# EAGLE design Gate_main (EAGLE 6.6.0)
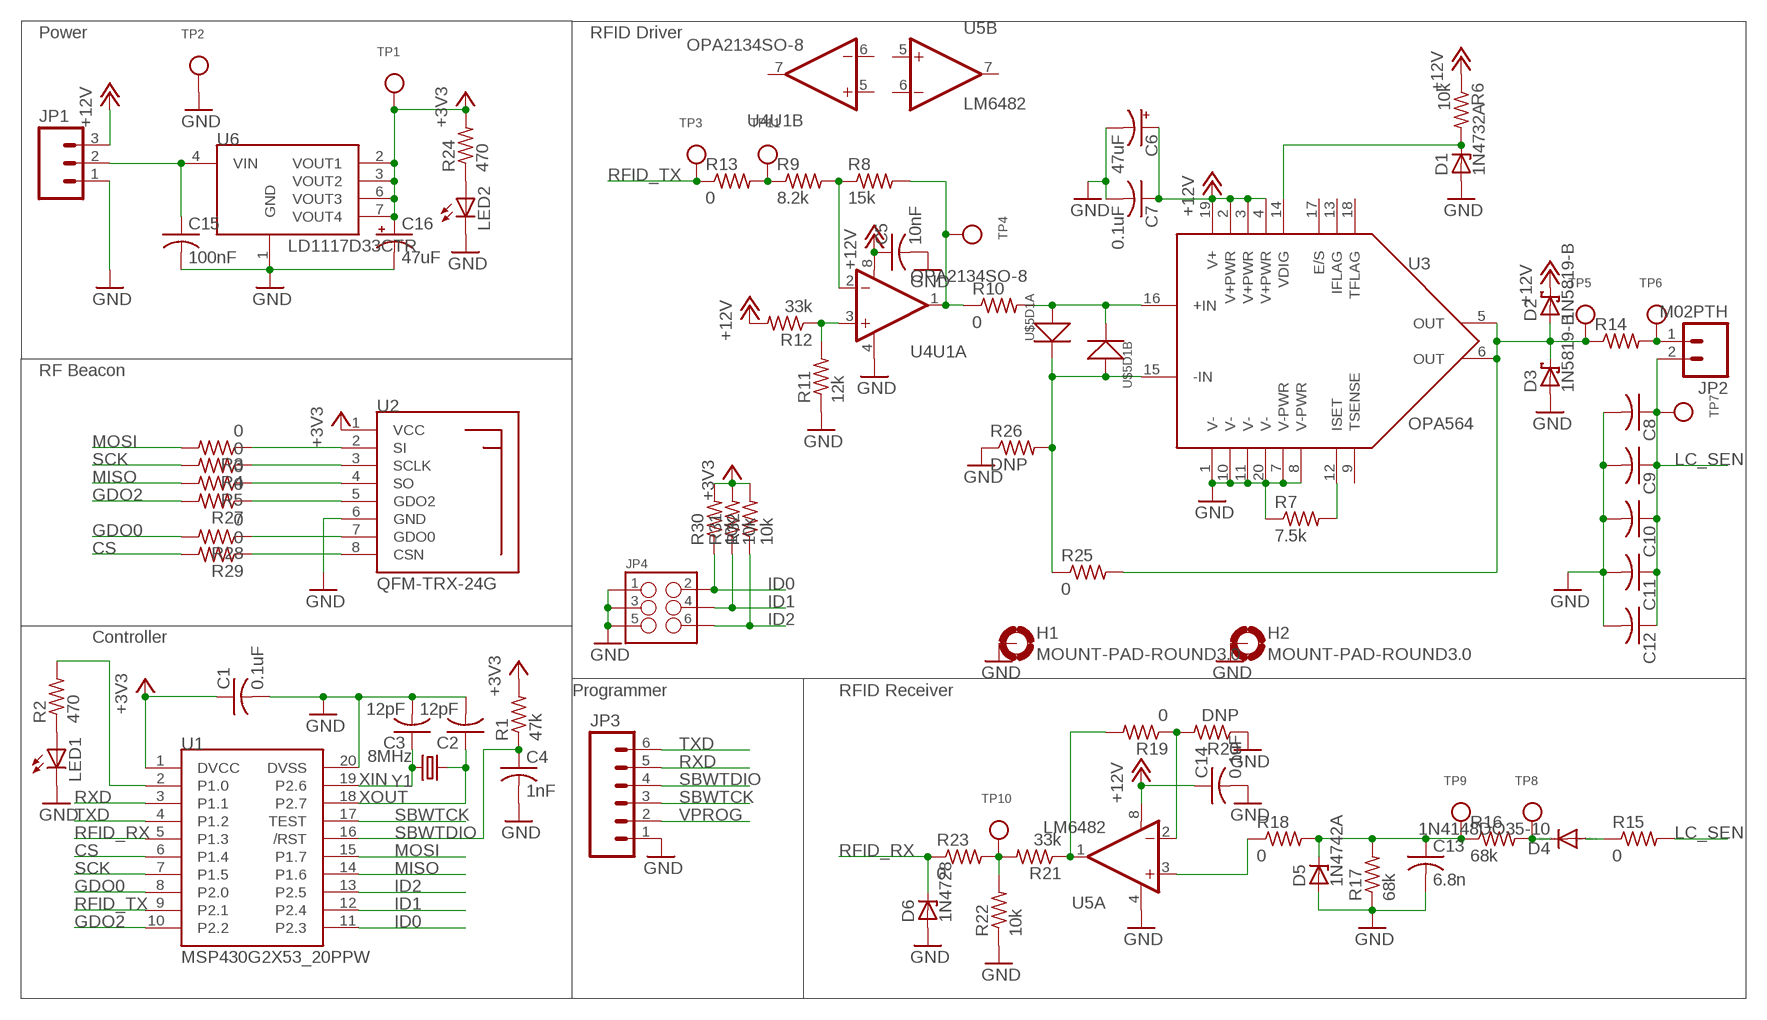
[diagram p0: schematic, sheet 1]

## Parts
C1  0.1uF  C-USC0805  [C0805]
C2  12pF  C-USC0805  [C0805]
C3  12pF  C-USC0805  [C0805]
C4  1nF  C-USC0805  [C0805]
C5  10nF  C-USC0805  [C0805]
C6  47uF  CPOL-USE2.5-6  [E2,5-6]
C7  0.1uF  C-USC0805  [C0805]
C8  C-USC0805  [C0805]
C9  C-USC0805  [C0805]
C10  C-USC0805  [C0805]
C11  C-USC0805  [C0805]
C12  C-USC0805  [C0805]
C13  6.8n  C-USC0805  [C0805]
C14  0.1uF  C-USC0805  [C0805]
C15  100nF  C-USC0805  [C0805]
C16  47uF  CPOL-USE2.5-6  [E2,5-6]
D1  1N4732A  1N4728  [DO41Z10]
D2  1N5819-B  [DO41-7.6]
D3  1N5819-B  [DO41-7.6]
D4  1N4148DO35-10  [DO35-10]
D5  1N4742A  1N4728  [DO41Z10]
D6  1N4728  [DO41Z10]
H1  MOUNT-PAD-ROUND3.0  [3,0-PAD]
H2  MOUNT-PAD-ROUND3.0  [3,0-PAD]
JP1  M03PTH  [1X03]
JP2  M02PTH  [1X02]
JP3  M06SIP  [1X06]
JP4  M03X22X3_SILK_SM  [2X3]
LED1  LEDCHIPLED_0603  [CHIPLED_0603]
LED2  LEDCHIPLED_0603  [CHIPLED_0603]
R1  47k  R-US_R0805  [R0805]
R2  470  R-US_R0805  [R0805]
R3  0  R-US_R0805  [R0805]
R4  0  R-US_R0805  [R0805]
R5  0  R-US_R0805  [R0805]
R6  10k  R-US_R0805  [R0805]
R7  7.5k  R-US_R0805  [R0805]
R8  15k  R-US_R0805  [R0805]
R9  8.2k  R-US_R0805  [R0805]
R10  0  R-US_R0805  [R0805]
R11  12k  R-US_R0805  [R0805]
R12  33k  R-US_R0805  [R0805]
R13  0  R-US_R0805  [R0805]
R14  R-US_0207/10  [0207/10]
R15  0  R-US_R0805  [R0805]
R16  68k  R-US_R0805  [R0805]
R17  68k  R-US_R0805  [R0805]
R18  0  R-US_R0805  [R0805]
R19  0  R-US_R0805  [R0805]
R20  DNP  R-US_R0805  [R0805]
R21  33k  R-US_R0805  [R0805]
R22  10k  R-US_R0805  [R0805]
R23  0  R-US_R0805  [R0805]
R24  470  R-US_R0805  [R0805]
R25  0  R-US_R0805  [R0805]
R26  DNP  R-US_R0805  [R0805]
R27  0  R-US_R0805  [R0805]
R28  0  R-US_R0805  [R0805]
R29  0  R-US_R0805  [R0805]
R30  10k  R-US_R0805  [R0805]
R31  10k  R-US_R0805  [R0805]
R32  10k  R-US_R0805  [R0805]
TP1  TESTPOINT0.1"  [1X01_ROUND]
TP2  TESTPOINT0.1"  [1X01_ROUND]
TP3  TESTPOINT0.1"  [1X01_ROUND]
TP4  TESTPOINT0.1"  [1X01_ROUND]
TP5  TESTPOINT0.1"  [1X01_ROUND]
TP6  TESTPOINT0.1"  [1X01_ROUND]
TP7  TESTPOINT0.1"  [1X01_ROUND]
TP8  TESTPOINT0.1"  [1X01_ROUND]
TP9  TESTPOINT0.1"  [1X01_ROUND]
TP10  TESTPOINT0.1"  [1X01_ROUND]
TP11  TESTPOINT0.1"  [1X01_ROUND]
U1  MSP430G2X53_20PPW  [PW(R-PDSO-G20)]
U2  QFM-TRX-24G  [QFM-TRX1-24G]
U3  OPA564  [SO-20LD]
U4  OPA2134SO-8  [SOIC8]
U5  LM6482  [SOIC8]
U6  LD1117D33CTR  [SOIC8]
U$5  SMS3922-015LF  [SMS3922-015LF]
Y1  8MHz  CRYSTALHC49UV  [HC49U-V]

## Nets
+3V3: C1.1 C16.+ R1.2 R24.2 R30.2 R31.2 R32.2 TP1.1 U1.1(DVCC) U2.1(VCC) U6.2(VOUT1) U6.3(VOUT2) U6.6(VOUT3) U6.7(VOUT4)
+6V: C15.1 JP1.2 U6.4(VIN)
+12V: C5.1 C6.+ C7.1 C14.1 D2.C JP1.3 R6.1 R12.2 U3.2(V+PWR) U3.3(V+PWR) U3.4(V+PWR) U3.19(V+) U4.8(U1A:V+) U5.8(A:V+)
BIAS_OUT: R8.2 R10.1 TP4.1 U4.1(U1A:OUT)
CS: R29.2 U1.6(P1.4)
GDO0: R28.2 U1.8(P2.0)
GDO2: R27.2 U1.10(P2.2)
GND: C1.2 C2.2 C3.2 C4.2 C5.2 C6.- C7.2 C8.2 C9.2 C10.2 C11.2 C12.2 C13.2 C14.2 C15.2 C16.- D1.A D3.A D5.A D6.A H1.B3,0(MOUNT) H2.B3,0(MOUNT) JP1.1 JP3.1 JP4.1 JP4.3 JP4.5 LED1.C LED2.C R7.1 R11.1 R17.1 R20.1 R22.1 R26.1 TP2.1 U1.20(DVSS) U2.6(GND) U3.1(V-) U3.7(V-PWR) U3.8(V-PWR) U3.10(V-) U3.11(V-) U3.20(V-) U4.4(U1A:V-) U5.4(A:V-) U6.1(GND)
ID0: JP4.2 R30.1 U1.11(P2.3)
ID1: JP4.4 R31.1 U1.12(P2.4)
ID2: JP4.6 R32.1 U1.13(P2.5)
ISET: R7.2 U3.12(ISET)
LC_SEN: C8.1 C9.1 C10.1 C11.1 C12.1 JP2.2 R15.2 TP7.1
MISO: R5.2 U1.14(P1.6)
MOSI: R3.2 U1.15(P1.7)
N$1: LED1.A R2.1
N$2: R5.1 U2.4(SO)
N$3: R4.1 U2.3(SCLK)
N$4: R3.1 U2.2(SI)
N$5: R8.1 R9.2 U4.2(U1A:-IN)
N$6: R10.2 U3.16(+IN) U$5.2(D1B:K) U$5.4(D1A:A)
N$7: R11.2 R12.1 U4.3(U1A:+IN)
N$8: R9.1 R13.2 TP11.1
N$9: JP2.1 R14.2 TP6.1
N$10: D4.C R16.2 TP8.1
N$11: D4.A R15.1
N$12: R25.1 R26.2 U3.15(-IN) U$5.1(D1A:K) U$5.3(D1B:A)
N$13: C13.1 D5.C R16.1 R17.2 R18.2 TP9.1
N$14: R19.1 R20.2 U5.2(A:-IN)
N$15: R19.2 R21.1 U5.1(A:OUT)
N$16: R18.1 U5.3(A:+IN)
N$17: R21.2 R22.2 R23.2 TP10.1
N$18: R2.2 U1.2(P1.0)
N$19: LED2.A R24.1
N$20: R29.1 U2.8(CSN)
N$21: R28.1 U2.7(GDO0)
N$22: R27.1 U2.5(GDO2)
PA_OUT: D2.A D3.C R14.1 R25.2 TP5.1 U3.5(OUT) U3.6(OUT)
RFID_RX: D6.C R23.1 U1.5(P1.3)
RFID_TX: R13.1 TP3.1 U1.9(P2.1)
RXD: JP3.5 U1.3(P1.1)
SBWTCK: JP3.3 U1.17(TEST)
SBWTDIO: C4.1 JP3.4 R1.1 U1.16(/RST)
SCK: R4.2 U1.7(P1.5)
TXD: JP3.6 U1.4(P1.2)
VDIG: D1.C R6.2 U3.14(VDIG)
VPROG: JP3.2
XIN: C3.1 U1.19(P2.6) Y1.2
XOUT: C2.1 U1.18(P2.7) Y1.1
Unconnected: U3.9(TSENSE) U3.13(IFLAG) U3.17(E/S) U3.18(TFLAG) U4.5(U1B:+IN) U4.6(U1B:-IN) U4.7(U1B:OUT) U5.5(B:+IN) U5.6(B:-IN) U5.7(B:OUT)

## Notes on the sheet
- Power | RFID Driver
- RF Beacon
- Controller
- Programmer | RFID Receiver

## Library data of the parts
C1-C5 C7-C15 = rcl:C-US: CAPACITOR, American symbol
C6 C16 = rcl:CPOL-US: POLARIZED CAPACITOR, American symbol
D1 D5 D6 = diode:1N4728: Z DIODE 3.3 V, 1W, 5 percent
D2 D3 = diode:1N581*: 1.0A SCHOTTKY BARRIER RECTIFIER Source: http://www.diodes.com/datasheets/ds23001.pdf
D4 = diode:1N4148: DIODE high speed (Philips)
H1 H2 = holes:MOUNT-PAD-ROUND: MOUNTING PAD, round
JP1 = SparkFun-Connectors:M03: Header 3 Standard 3-pin 0.1" header. Use with straight break away headers (SKU : PRT-00116), right angle break away headers (PRT-00553), swiss pins (PRT-00743), machine pins (PRT-00117), and female headers (PRT-00115). Molex polarized connector foot print use with SKU : PRT-08232 with associated crimp pins and housings.
JP2 = SparkFun-Connectors:M02: Standard 2-pin 0.1" header. Use with - straight break away headers ( PRT-00116) - right angle break away headers (PRT-00553) - swiss pins (PRT-00743) - machine pins (PRT-00117) - female headers (PRT-00115) Molex polarized connector foot print use with: PRT-08233 with associated crimp pins and housings. 2.54_SCREWTERM for use with PRT-10571. 3.5mm Screw Terminal footprints for PRT-08084 5mm Screw Terminal footprints for use with PRT-08433
JP3 = SparkFun-Connectors:M06: Header 6 Standard 6-pin 0.1" header. Use with straight break away headers (SKU : PRT-00116), right angle break away headers (PRT-00553), swiss pins (PRT-00743), machine pins (PRT-00117), and female headers (PRT-00115). Molex polarized connector foot print use with SKU : PRT-08094 with associated crimp pins and housings. NOTES ON THE VARIANTS LOCK and LOCK_LONGPADS... This footprint was designed to help hold the alignment of a through-hole component (i.e. 6-pin header) while soldering it into place. You may notice that each hole has been shifted either up or down by 0.005 of an inch from it's more standard position (which is a perfectly straight line). This slight alteration caused the pins (the squares in the middle) to touch the edges of the holes. Because they are alternating, it causes a "brace" to hold the component in place. 0.005 has proven to be the perfect amount of "off-center" position when using our standard breakaway headers. Although looks a little odd when you look at the bare footprint, once you have a header in there, the alteration is very hard to notice. Also,if you push a header all the way into place, it is covered up entirely on the bottom side. This idea of altering the position of holes to aid alignment will be further integrated into the Sparkfun Library for other footprints. It can help hold any component with 3 or more connection pins.
JP4 = SparkFun-Connectors:M03X2: 2x3 .1" header. Shrouded, with keying- CONN-10681 SMT- CONN-11415 Pogo pins- HW-11044
LED1 LED2 = led:LED: LED OSRAM: - CHIPLED LG R971, LG N971, LY N971, LG Q971, LY Q971, LO R971, LY R971 LH N974, LH R974 LS Q976, LO Q976, LY Q976 LO Q996 - Hyper CHIPLED LW Q18S LB Q993, LB Q99A, LB R99A - SideLED LS A670, LO A670, LY A670, LG A670, LP A670 LB A673, LV A673, LT A673, LW A673 LH A674 LY A675 LS A676, LA A676, LO A676, LY A676, LW A676 LS A679, LY A679, LG A679 - Hyper Micro SIDELED® LS Y876, LA Y876, LO Y876, LY Y876 LT Y87S - SmartLED LW L88C, LW L88S LB L89C, LB L89S, LG L890 LS L89K, LO L89K, LY L89K LS L896, LA L896, LO L896, LY L896 - TOPLED LS T670, LO T670, LY T670, LG T670, LP T670 LSG T670, LSP T670, LSY T670, LOP T670, LYG T670 LG T671, LOG T671, LSG T671 LB T673, LV T673, LT T673, LW T673 LH T674 LS T676, LA T676, LO T676, LY T676, LB T676, LH T676, LSB T676, LW T676 LB T67C, LV T67C, LT T67C, LS T67K, LO T67K, LY T67K, LW E67C LS E67B, LA E67B, LO E67B, LY E67B, LB E67C, LV E67C, LT E67C LW T67C LS T679, LY T679, LG T679 LS T770, LO T770, LY T770, LG T770, LP T770 LB T773, LV T773, LT T773, LW T773 LH T774 LS E675, LA E675, LY E675, LS T675 LS T776, LA T776, LO T776, LY T776, LB T776 LHGB T686 LT T68C, LB T68C - Hyper Mini TOPLED® LB M676 - Mini TOPLED Santana® LG M470 LS M47K, LO M47K, LY M47K Source: http://www.osram.convergy.de LUXEON: - LUMILED® LXK2-PW12-R00, LXK2-PW12-S00, LXK2-PW14-U00, LXK2-PW14-V00 LXK2-PM12-R00, LXK2-PM12-S00, LXK2-PM14-U00 LXK2-PE12-Q00, LXK2-PE12-R00, LXK2-PE12-S00, LXK2-PE14-T00, LXK2-PE14-U00 LXK2-PB12-K00, LXK2-PB12-L00, LXK2-PB12-M00, LXK2-PB14-N00, LXK2-PB14-P00, LXK2-PB14-Q00 LXK2-PR12-L00, LXK2-PR12-M00, LXK2-PR14-Q00, LXK2-PR14-R00 LXK2-PD12-Q00, LXK2-PD12-R00, LXK2-PD12-S00 LXK2-PH12-R00, LXK2-PH12-S00 LXK2-PL12-P00, LXK2-PL12-Q00, LXK2-PL12-R00 Source: www.luxeon.com KINGBRIGHT: KA-3528ASYC Source: www.kingbright.com
R1-R32 = rcl:R-US_: RESISTOR, American symbol
TP1-TP11 = microbuilder:TESTPOINT: Test Point Various test points for characterisation and PCB testing TESTPOINT_SMT - Compact Surface Mount Test Point [Digikey: 5016KTR-ND]; BOM: EXCLUDE
U1 = npol:MSP430G2X53_20P: MSP430G2x53 16-bit Microcontroller, 20pin devices
U2 = npol:QFM-TRX-24G
U3 = npol:OPA564
U4 = npol:OPA2134
U5 = npol:LM6482
U6 = npol:LD1117D33CTR
U$5 = npol:SMS3922-015LF
Y1 = SparkFun-FreqCtrl:CRYSTAL: Various standard crystals. Proven footprints. Spark Fun Electronics SKU : COM-00534

## Board
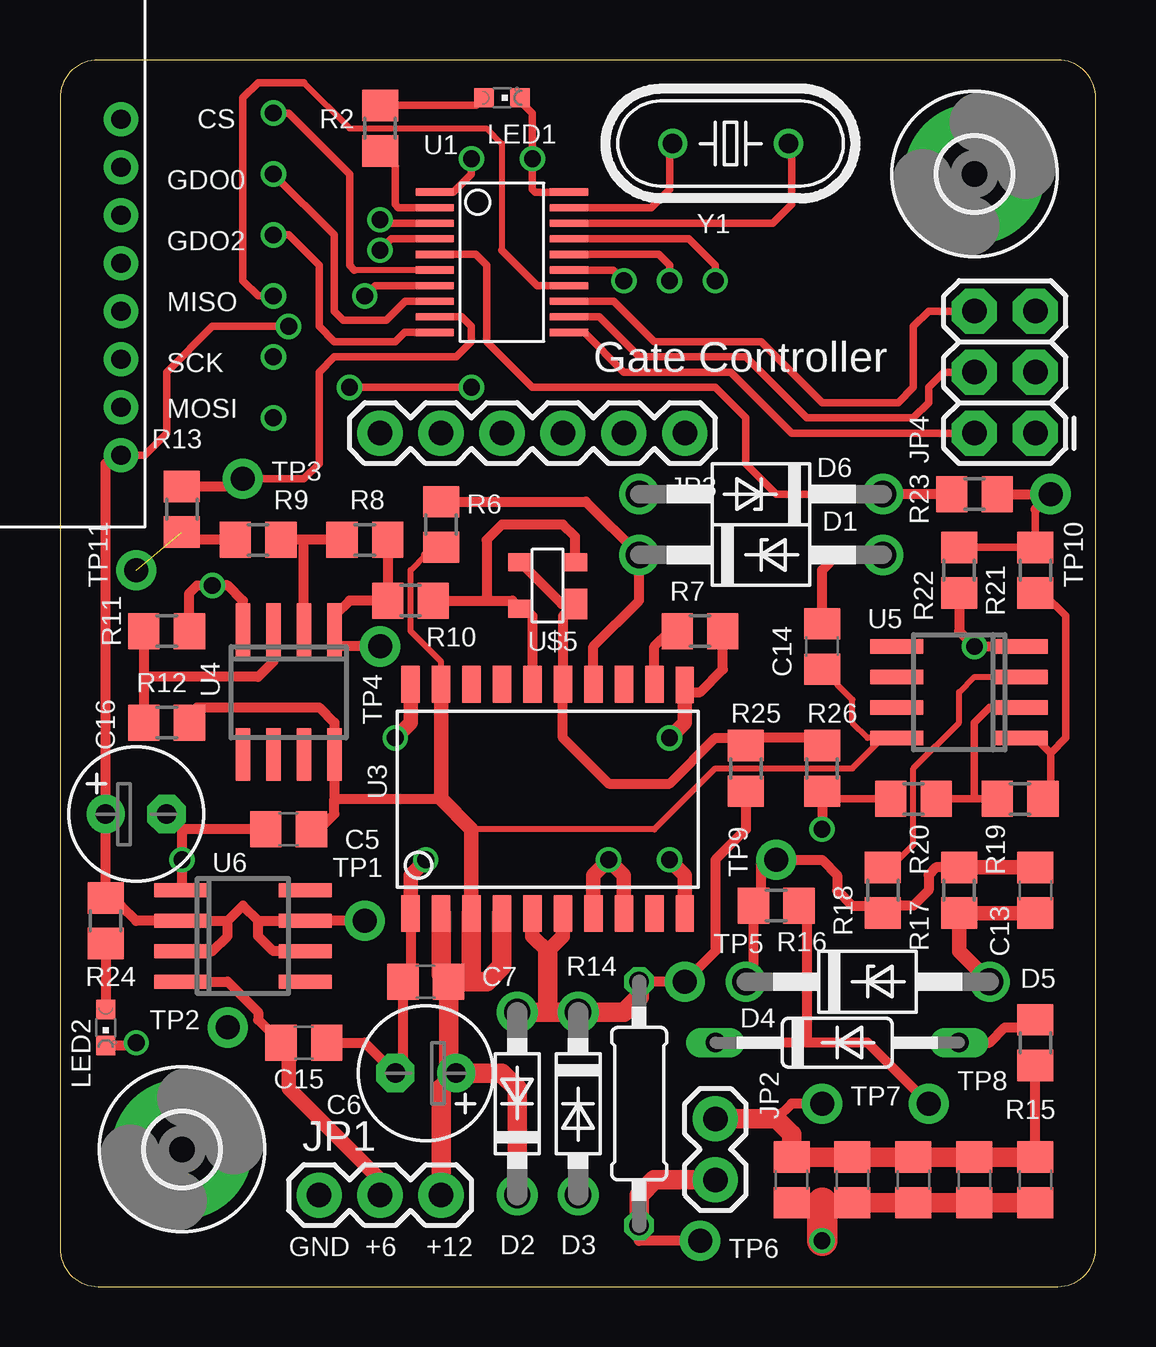
[diagram p1: board, top side]
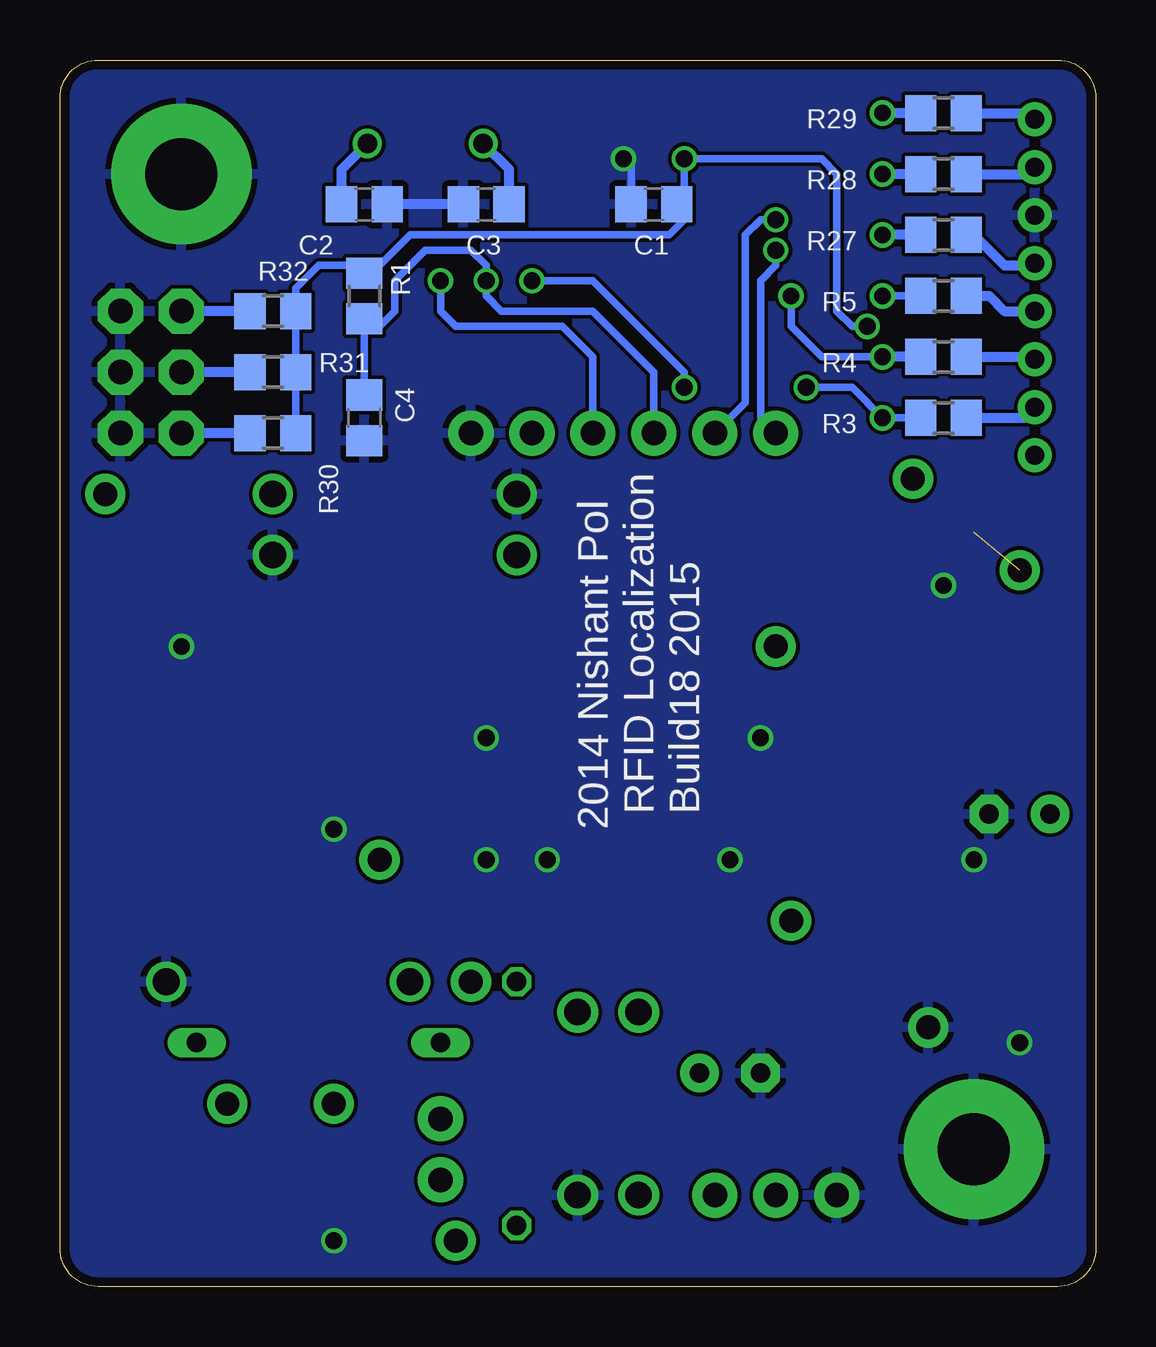
[diagram p2: board, bottom side, seen from below]

Size 43.16 x 51.1 mm. Coordinates in mm from the lower left corner, seen from the top.
Outline: 0,49.52 0,1.59 arc90 1.59,0 41.57,0 arc90 43.16,1.59 43.16,49.52 arc90 41.57,51.1 1.59,51.1 arc90 0,49.52
Copper layers (1*16): Top 0.0356mm / dielectric 1.5011mm / Bottom 0.0356mm
Design rules "OshPark": minimum track width 6mil, minimum drill 13mil, track to track 6mil, track to pad 6mil, pad to pad 6mil, via to via 6mil, smd to smd 6mil, copper to edge 15mil, drill to drill 6mil, minimum pad ring 7mil, minimum via ring 7mil, stop-mask expansion 4mil, vias tented up to drill 0mil, thermal gap 10mil

### Footprints (pad centres in the part's own frame; a part is rotated, then mirrored left to right if it is on the bottom)
C0805 = smd 1.3 x 1.5: 1 -0.95,0; 2 0.95,0
E2,5-6 = drill 0.813 pad 1.6: + -1.27,0 | drill 0.813 pad 1.6 octagon: - 1.27,0
DO41Z10 = drill 1.118: A 5.08,0; C -5.08,0
DO41-7.6 = drill 1.1 pad 1.7: A 3.81,0; C -3.81,0
DO35-10 = drill 0.813 long: A 5.08,0; C -5.08,0
3,0-PAD = drill 3 pad 5.842: B3,0 0,0
1X03 = drill 1.016 pad 1.88: 1 0,0; 2 2.54,0; 3 5.08,0
1X02 = drill 1.016 pad 1.88: 1 0,0; 2 2.54,0
1X06 = drill 1.016 pad 1.88: 1 0,0; 2 2.54,0; 3 5.08,0; 4 7.62,0; 5 10.16,0; 6 12.7,0
2X3 = drill 1.016 pad 1.88 octagon: 1 0,0; 2 0,2.54; 3 2.54,0; 4 2.54,2.54; 5 5.08,0; 6 5.08,2.54
CHIPLED_0603 = smd 0.8 x 0.8: A 0,-0.75; C 0,0.75
R0805 = smd 1.3 x 1.5: 1 -0.95,0; 2 0.95,0
0207/10 = drill 0.813 octagon: 1 -5.08,0; 2 5.08,0
1X01_ROUND = drill 1 pad 1.676: 1 0,0
PW(R-PDSO-G20) = smd 0.3 x 1.6: 1 -2.425,-2.8; 2 -1.775,-2.8; 3 -1.125,-2.8; 4 -0.475,-2.8; 5 0.175,-2.8; 6 0.825,-2.8; 7 1.475,-2.8; 8 2.125,-2.8; 9 2.775,-2.8; 10 3.425,-2.8; 11 3.425,2.8; 12 2.775,2.8; 13 2.125,2.8; 14 1.475,2.8; 15 0.825,2.8; 16 0.175,2.8; 17 -0.475,2.8; 18 -1.125,2.8; 19 -1.775,2.8; 20 -2.425,2.8
QFM-TRX1-24G = drill 0.8 pad 1.422: 1 -6,0; 2 -4,0; 3 -2,0; 4 0,0; 5 2,0; 6 4,0; 7 6,0; 8 8,0
SO-20LD = smd 0.762 x 1.524: 1 -5.715,-4.775; 2 -4.445,-4.775; 3 -3.175,-4.775; 4 -1.905,-4.775; 5 -0.635,-4.775; 6 0.635,-4.775; 7 1.905,-4.775; 8 3.175,-4.775; 9 4.445,-4.775; 10 5.715,-4.775; 11 5.715,4.75; 12 4.445,4.775; 13 3.175,4.775; 14 1.905,4.775; 15 0.635,4.775; 16 -0.635,4.775; 17 -1.905,4.775; 18 -3.175,4.775; 19 -4.445,4.775; 20 -5.715,4.775
SOIC8 = smd 0.6 x 2.2: 1 -1.905,-2.6; 2 -0.635,-2.6; 3 0.635,-2.6; 4 1.905,-2.6; 5 1.905,2.6; 6 0.635,2.6; 7 -0.635,2.6; 8 -1.905,2.6
SMS3922-015LF = smd 1.27 x 1.016: 1 -0.762,-1.143 | smd 0.762 x 1.016: 2 0.965,-1.143; 3 0.965,1.143; 4 -0.965,1.143
HC49U-V = drill 0.813: 1 -2.413,0; 2 2.413,0

### Placement (x,y rotation side)
C1  18.41,45.09 180 bottom
C2  30.48,45.09 0 bottom
C3  25.4,45.09 180 bottom
C4  30.48,36.2 270 bottom
C5  9.53,19.05 180 top
C6  15.24,8.89 180 top
C7  15.24,12.7 180 top
C8  40.64,4.45 270 top
C9  38.1,4.45 270 top
C10  33.02,4.45 270 top
C11  35.56,4.45 270 top
C12  30.48,4.45 270 top
C13  40.64,16.51 270 top
C14  31.75,26.67 90 top
C15  10.16,10.16 0 top
C16  3.17,19.68 0 top
D1  29.21,30.48 0 top
D2  19.05,7.62 90 top
D3  21.59,7.62 270 top
D4  32.38,10.16 0 top
D5  33.66,12.7 0 top
D6  29.21,33.02 180 top
H1  38.1,46.35 0 top
H2  5.08,5.71 0 top
JP1  10.79,3.81 0 top
JP2  27.3,4.45 90 top
JP3  26.04,35.56 180 top
JP4  40.64,35.56 90 top
LED1  18.41,49.53 270 top
LED2  1.91,10.79 180 top
R1  30.48,41.27 90 bottom
R2  13.34,48.26 270 top
R3  6.35,36.2 180 bottom
R4  6.35,38.73 180 bottom
R5  6.35,41.27 180 bottom
R6  15.88,31.75 90 top
R7  26.67,27.3 180 top
R8  12.7,31.11 0 top
R9  8.26,31.11 0 top
R10  14.61,28.57 0 top
R11  4.45,27.3 180 top
R12  4.45,23.5 0 top
R13  5.08,32.38 270 top
R14  24.13,7.62 270 top
R15  40.64,10.16 270 top
R16  29.84,15.88 0 top
R17  37.47,16.51 90 top
R18  34.29,16.51 270 top
R19  40.01,20.32 0 top
R20  35.56,20.32 0 top
R21  40.64,29.84 90 top
R22  37.47,29.84 90 top
R23  38.1,33.02 0 top
R24  1.91,15.24 90 top
R25  28.57,21.59 270 top
R26  31.75,21.59 90 top
R27  6.35,43.81 180 bottom
R28  6.35,46.35 180 bottom
R29  6.35,48.9 180 bottom
R30  34.29,35.56 0 bottom
R31  34.29,38.1 0 bottom
R32  34.29,40.64 0 bottom
TP1  12.7,15.24 0 top
TP2  6.99,10.79 0 top
TP3  7.62,33.66 0 top
TP4  13.34,26.67 0 top
TP5  26.04,12.7 0 top
TP6  26.67,1.91 0 top
TP7  31.75,7.62 0 top
TP8  36.2,7.62 0 top
TP9  29.84,17.78 0 top
TP10  41.27,33.02 0 top
TP11  3.17,29.84 0 top
U1  18.41,43.18 270 top
U2  2.54,40.64 90 top
U3  20.32,20.32 0 top
U4  9.53,24.77 180 top
U5  37.47,24.77 90 top
U6  7.62,14.61 270 top
U$5  20.32,29.21 90 top
Y1  27.94,47.62 180 top

### Tracks (layer width: path | path; a pad name or v marks a point on that pad's centre or on a via)
+3V3  (via drill 0.7)
  Top 0.305: 1.91,34.29 2.19,34.29 U2.1 3.52,34.64 4.45,35.56 4.45,38.1 6.35,40.01 v9.53,40.01 | U1.1 16.39,45.6 17.14,46.35 v17.14,46.99
  Top 0.406: U6.3 6.35,13.97 6.99,14.61 6.99,15.24 | U6.6 8.89,13.97 8.26,14.61 8.26,15.24 | 8.26,15.24 U6.7 TP1.1 | 6.99,15.24 U6.2 3.17,15.24 2.54,15.88 2.22,15.88 R24.2 C16.+ 1.91,34.29 | 6.99,15.24 7.62,15.88 8.26,15.24
  Bottom 0.305: R30.2 R31.2 R32.2 33.34,41.59 32.38,42.55 30.8,42.55 R1.2 30.16,42.23 28.57,43.81 17.78,43.81 17.14,44.45 17.14,44.77 | 17.14,44.77 C1.1 | v9.53,40.01 10.16,40.01 10.79,40.64 10.79,46.35 11.43,46.99 v17.14,46.99 17.14,44.77
+6V
  Top 0.406: U6.4 6.99,12.7 8.26,11.43 8.26,11.12 C15.1
  Top 0.61: JP1.2 13.34,4.45 9.53,8.26 9.53,9.85 C15.1
+12V
  Top 0.254: U3.19 15.88,26.04 14.61,27.3 14.61,29.84 15.24,30.48 | 17.14,19.05 24.77,19.05 27.3,21.59 33.02,21.59 34.29,22.86 | 34.29,22.86 U5.8 | 34.29,22.86 33.66,22.86 33.02,23.5 33.02,24.45 C14.1
  Top 0.406: 11.43,20.32 U4.8 11.43,23.5 10.79,24.13 5.71,24.13 5.39,23.81 R12.2 | 11.43,20.32 15.88,20.32 | C5.1 10.79,19.05 11.43,19.68 11.43,20.32 | 15.24,30.48 15.88,30.48 R6.1
  Top 0.61: U3.19 15.88,20.32 17.14,19.05 U3.3
  Top 0.813: C6.+ 18.41,8.89 19.05,8.26 D2.C | U3.3 17.14,12.7 | 17.14,12.7 C7.1 | U3.2 15.88,13.02 C7.1 | U3.4 18.41,13.34 17.78,12.7 17.14,12.7 | JP1.3 15.88,8.26 C6.+ | C7.1 16.19,9.21 C6.+
BIAS_OUT
  Top 0.406: TP4.1 11.43,26.67 U4.1 11.43,27.94 12.06,28.57 R10.1 R8.2
CS  (via drill 0.7)
  Top 0.254: U1.6 12.26,42.35
  Top 0.305: v8.89,48.9 9.53,48.9 12.06,46.35 12.06,42.55 12.26,42.35
  Bottom 0.406: R29.2 v8.89,48.9
GDO0  (via drill 0.7)
  Top 0.305: v8.89,46.35 11.43,43.81 11.43,40.64 11.8,40.27 13.6,40.27 14.38,41.05 U1.8
  Bottom 0.406: R28.2 v8.89,46.35
GDO2  (via drill 0.7)
  Top 0.305: v8.89,43.81 9.53,43.81 10.79,42.55 10.79,40.01 11.43,39.37 13.97,39.37 14.36,39.76 U1.10
  Bottom 0.406: R27.2 v8.89,43.81
GND  (via drill 0.7)
  Top 0.305: LED1.C 19.16,49.41 19.68,48.9 v19.68,46.99 19.68,45.72 19.8,45.6 U1.20 | R20.1 32.07,20.32 R26.1
  Top 0.406: U3.1 14.61,13.02 C7.2 14.29,9.21 C6.- 12.7,10.16 C15.2 | R26.1 v31.75,19.05 | LED2.C 3.06,10.04 v3.17,10.16 | C16.- 5.08,19.05 | 5.08,19.05 v5.08,17.78 5.08,16.57 U6.1 | R11.1 5.39,28.89 5.71,29.21 v6.35,29.21 6.99,29.21 7.62,28.57 U4.4 | 26.04,24.77 26.67,24.77 27.62,25.71 R7.1 | 40.01,26.67 U5.4 v38.1,26.67 37.47,27.3 R22.1 | C14.2 31.75,29.84 32.38,30.48 D1.A | C5.2 5.08,19.05
  Top 0.61: U3.1 14.61,17.14 v15.24,17.78 | U3.7 22.23,17.14 v22.86,17.78 23.5,17.14 U3.8 | U3.10 26.04,17.14 v25.4,17.78 | U3.20 14.61,23.5 v13.97,22.86 | U3.11 26.04,24.77 26.04,23.5 v25.4,22.86 | C13.2 R17.1 37.47,13.97 D5.A
  Top 0.813: C12.2 31.75,3.5 C10.2 C11.2 C9.2 C8.2
  Top 1.27: v31.75,1.91 31.75,3.5
  Bottom 0.305: C1.2 19.36,46.67 v19.68,46.99
  Bottom 0.406: C3.2 C2.2
  pour Bottom: 0,0 43.18,0 43.18,51.44 0,51.44
ID0
  Top 0.305: JP4.2 30.48,35.56 27.94,38.1 23.5,38.1 21.84,39.76 U1.11
  Bottom 0.406: R30.1 JP4.2
ID1
  Top 0.305: JP4.4 36.83,38.1 36.2,37.47 36.2,36.83 35.56,36.2 31.11,36.2 28.57,38.73 24.13,38.73 22.46,40.41 U1.12
  Bottom 0.406: R31.1 JP4.4
ID2
  Top 0.305: JP4.6 36.2,40.64 35.56,40.01 35.56,37.47 34.92,36.83 31.75,36.83 29.21,39.37 24.77,39.37 23.08,41.05 U1.13
  Bottom 0.406: R32.1 JP4.6
ISET
  Top 0.406: U3.12 24.77,26.67 25.4,27.3 R7.2
LC_SEN
  Top 0.406: C8.1 R15.2 | TP7.1 30.48,7.62 29.84,6.99
  Top 0.813: JP2.2 29.84,6.99 30.48,6.35 C12.1 C10.1 C11.1 C9.1 C8.1
MISO  (via drill 0.7)
  Top 0.254: 18.41,43.18 18.41,47.62 17.78,48.26 12.06,48.26 10.16,50.16
  Top 0.305: v8.89,41.27 8.26,41.27 7.62,41.91 7.62,49.53 8.26,50.16 10.16,50.16 | U1.14 19.89,41.7 18.41,43.18
  Bottom 0.305: R5.2 v8.89,41.27
MOSI  (via drill 0.7)
  Top 0.305: v12.06,37.47 v17.14,37.47 | U1.15 23.05,42.35 v23.5,41.91
  Bottom 0.305: R3.2 v8.89,36.2 10.16,37.47 v12.06,37.47 | v23.5,41.91 20.95,41.91 17.14,38.1 v17.14,37.47
N$1
  Top 0.305: R2.1 17.34,49.21 LED1.A
N$2
  Bottom 0.406: R5.1 4.45,41.27 3.81,40.64 U2.4
N$3
  Bottom 0.406: R4.1 2.63,38.73 U2.3
N$4
  Bottom 0.406: R3.1 2.98,36.2 U2.2
N$5
  Top 0.406: U4.2 10.16,31.11 | 10.16,31.11 R9.2 | R8.1 10.16,31.11
N$6
  Top 0.406: U3.16 19.68,27.94 19.38,28.25 U$5.4 18.85,28.57 17.78,28.57 | U$5.2 21.46,31.24 20.95,31.75 18.41,31.75 17.78,31.11 17.78,28.57 | R10.2 17.78,28.57
N$7
  Top 0.406: R11.2 3.5,25.4 | 3.5,25.4 R12.1 | U4.3 8.89,26.04 8.26,25.4 3.5,25.4
N$8  (1 unrouted)
  Top 0.406: R9.1 5.4,31.11 R13.2
N$9
  Top 0.406: TP6.1 24.13,1.91 R14.2
  Top 0.813: JP2.1 24.77,4.45 24.13,3.81 R14.2
N$10
  Top 0.406: R16.2 30.8,15.56 31.11,15.24 31.11,10.16 | 31.11,10.16 30.48,10.16 D4.C | TP8.1 33.66,10.16 31.11,10.16
N$11
  Top 0.406: D4.A 38.73,10.16 39.37,10.79 40.33,10.79 R15.1
N$12
  Top 0.406: U$5.3 20.9,28.45 U$5.1 20.95,27.94 U3.15 20.95,22.86 22.86,20.95 25.4,20.95 27.3,22.86 27.94,22.86 28.26,22.54 R25.1 28.89,22.54 29.21,22.86 31.43,22.86 R26.2
N$13
  Top 0.406: D5.C 28.89,13.02 R16.1 29.21,16.19 29.21,17.78 TP9.1 31.75,17.78 32.38,17.14 32.38,16.51 33.02,15.88 33.98,15.88 R18.2 34.6,15.88 35.56,15.88 36.2,16.51 36.2,17.14 36.51,17.46 R17.2
  Top 0.61: C13.1 R17.2
N$14
  Top 0.305: U5.2 38.73,24.13 38.1,23.5 38.1,20.32 R19.1 R20.2
N$15
  Top 0.305: U5.1 40.64,22.86 41.27,22.23 | 41.27,22.23 41.27,20.64 R19.2 | R21.1 40.95,28.89 41.91,27.94 41.91,22.86 41.27,22.23
N$16
  Top 0.254: R18.1 34.6,17.46 35.56,18.41 35.56,21.59 37.47,23.5 37.47,24.77 38.1,25.4 U5.3
N$17
  Top 0.305: 40.64,32.38 R21.2 R22.2
  Top 0.406: R23.2 TP10.1 40.64,32.38
N$18
  Top 0.305: R2.2 13.97,46.67 13.97,45.09 14.1,44.95 U1.2
N$19
  Top 0.406: R24.1 LED2.A
N$20
  Bottom 0.406: R29.1 2.79,48.9 U2.8
N$21
  Bottom 0.406: R28.1 2.83,46.35 U2.7
N$22
  Bottom 0.406: R27.1 5.08,43.81 3.81,42.55 2.63,42.55 U2.5
PA_OUT
  Top 0.406: R25.2 28.57,19.05 27.3,17.78 27.3,13.97 TP5.1 R14.1
  Top 0.61: U3.5 19.68,14.61 20.32,13.97 20.95,14.61 U3.6
  Top 0.813: D2.A 20.32,11.43 | 20.32,11.43 D3.C 23.5,11.43 24.13,12.06 R14.1 | 20.32,11.43 20.32,13.97
RFID_RX
  Top 0.305: D6.C 29.84,33.02 28.57,34.29 28.57,36.2 27.3,37.47 19.68,37.47 17.78,39.37 17.78,42.55 17.32,43.01 U1.5
  Top 0.406: R23.1 D6.C
RFID_TX
  Top 0.305: TP3.1 10.16,33.66 10.79,34.29 10.79,38.1 11.43,38.73 16.51,38.73 17.14,39.37 17.14,40.01 16.75,40.41 U1.9
  Top 0.406: R13.1 7.3,33.34 TP3.1
RXD  (via drill 0.7)
  Top 0.305: U1.3 13.48,44.3 v13.34,44.45
  Bottom 0.305: v13.34,44.45 13.97,44.45 14.61,43.81 14.61,36.83 JP3.5
SBWTCK  (via drill 0.7)
  Top 0.305: U1.17 26.2,43.66 27.3,42.55 v27.3,41.91
  Bottom 0.305: JP3.3 20.95,38.73 22.23,40.01 26.67,40.01 27.3,40.64 v27.3,41.91
SBWTDIO  (via drill 0.7)
  Top 0.305: U1.16 24.94,43.01 25.4,42.55 v25.4,41.91
  Bottom 0.305: C4.1 R1.1 30.16,40.01 29.84,40.01 29.21,40.64 29.21,41.91 27.94,43.18 26.04,43.18 25.4,42.55 v25.4,41.91 25.4,41.27 24.77,40.64 20.95,40.64 18.41,38.1 JP3.4
SCK  (via drill 0.7)
  Top 0.305: U1.7 13.13,41.7 v12.7,41.27
  Bottom 0.305: v12.7,41.27 12.7,40.01 11.43,38.73 v8.89,38.73
  Bottom 0.406: R4.2 v8.89,38.73
TXD  (via drill 0.7)
  Top 0.305: U1.4 13.81,43.66 v13.34,43.18
  Bottom 0.305: v13.34,43.18 13.34,42.55 13.97,41.91 13.97,36.2 JP3.6
VDIG
  Top 0.406: U3.14 22.23,26.67 24.13,28.57 D1.C 21.91,32.7 R6.2
XIN
  Top 0.305: Y1.2 25.4,47.5 25.4,45.72 24.64,44.95 U1.19
  Bottom 0.406: C3.1 24.45,46.55 Y1.2
XOUT
  Top 0.305: Y1.1 30.48,47.5 30.48,45.09 29.7,44.3 U1.18
  Bottom 0.406: C2.1 31.43,46.55 Y1.1

### Text on the board
tNames: CS | GDO0 | GDO2 | MISO | SCK | Gate Controller | MOSI | GND | +6 | +12
bNames: Build18 2015 | RFID Localization | 2014 Nishant Pol